# EAGLE design BR85_MKL_3309_21MTC_J0_004_01_06 (EAGLE 5.10)
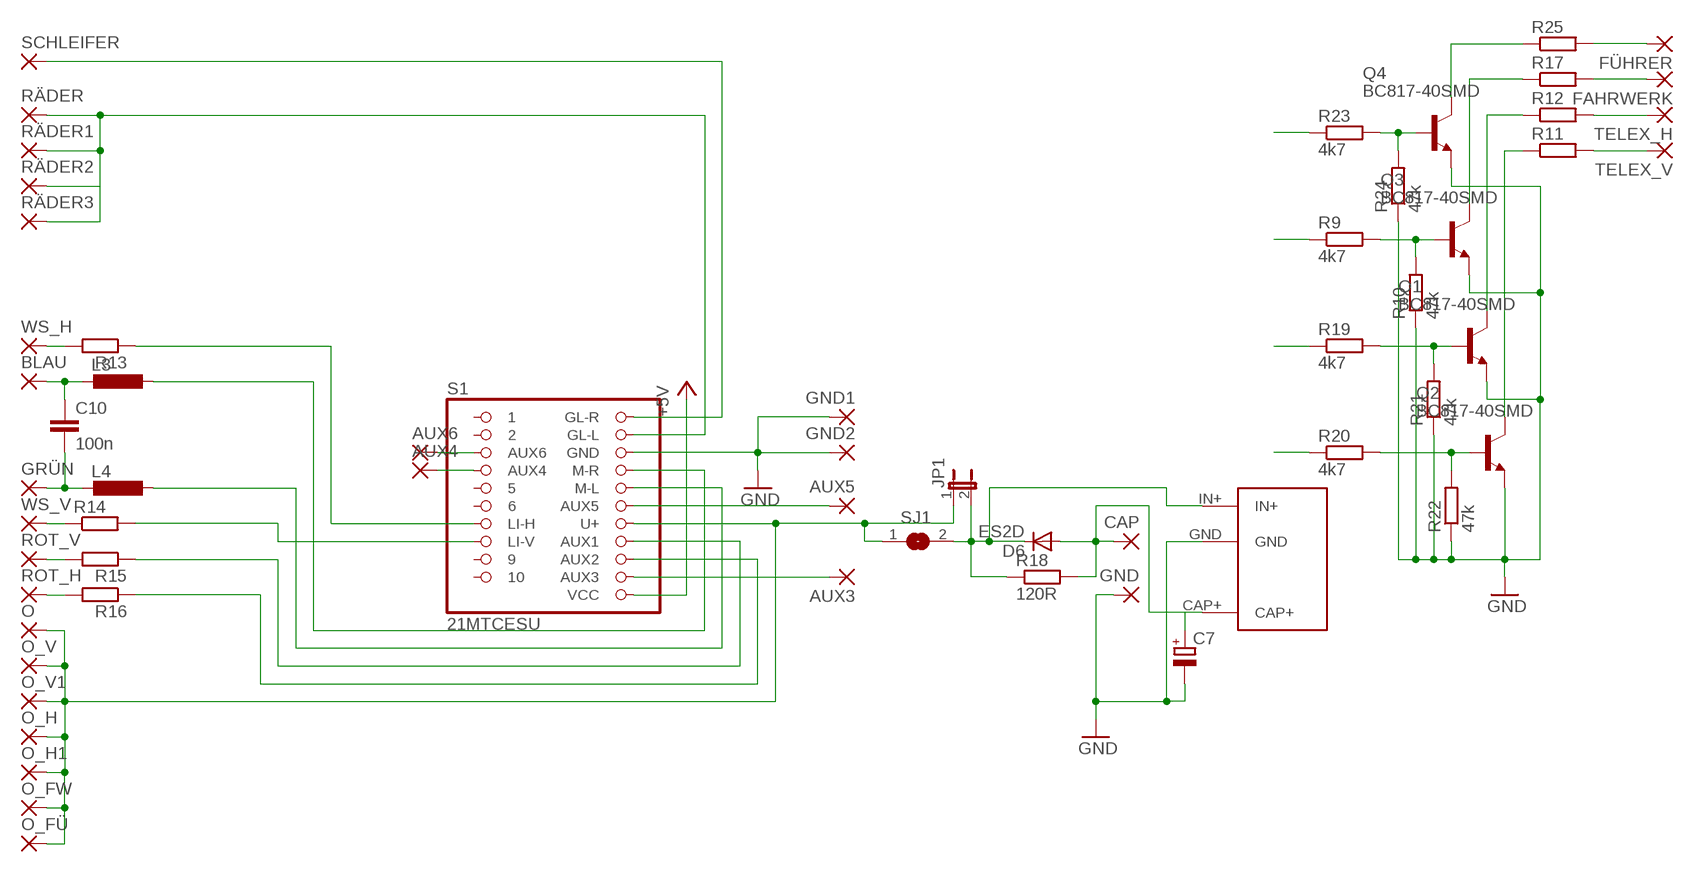
[diagram p0: schematic, sheet 1]

## Parts
AUX3  SMD2  [SMD1,27-2,54]
AUX4  SMD2  [SMD1,27-2,54]
AUX5  SMD2  [SMD1,27-2,54]
AUX6  SMD2  [SMD1,27-2,54]
BLAU  SMD2  [SMD1,27-2,54]
C7  CPOL-EURECT  [RECT-13X14-9]
C10  100n  C-EUC0603  [C0603]
CAP  SMD2  [SMD1,27-2,54]
D6  ES2D  [SMB]
FAHRWERK  SMD2  [SMD1,27-2,54]
FÜHRER  SMD2  [SMD1,27-2,54]
GND  SMD2  [SMD1,27-2,54]
GND1  SMD2  [SMD1,27-2,54]
GND2  SMD2  [SMD1,27-2,54]
GRÜN  SMD2  [SMD1,27-2,54]
JP1  JP1E2,00  [JP1_2]
L3  L-EUL1212  [L1212]
L4  L-EUL1212  [L1212]
O  SMD2  [SMD1,27-2,54]
O_FW  SMD2  [SMD1,27-2,54]
O_FÜ  SMD2  [SMD1,27-2,54]
O_H  SMD2  [SMD1,27-2,54]
O_H1  SMD2  [SMD1,27-2,54]
O_V  SMD2  [SMD1,27-2,54]
O_V1  SMD2  [SMD1,27-2,54]
Q1  BC817-40SMD  [SOT23-BEC]
Q2  BC817-40SMD  [SOT23-BEC]
Q3  BC817-40SMD  [SOT23-BEC]
Q4  BC817-40SMD  [SOT23-BEC]
R9  4k7  R-EU_R0603  [R0603]
R10  47k  R-EU_R0603  [R0603]
R11  R-EU_R0603S  [R0603S]
R12  R-EU_R0603S  [R0603S]
R13  R-EU_R0603S  [R0603S]
R14  R-EU_R0603S  [R0603S]
R15  R-EU_R0603S  [R0603S]
R16  R-EU_R0603S  [R0603S]
R17  R-EU_R0603S  [R0603S]
R18  120R  R-EU_R0603  [R0603]
R19  4k7  R-EU_R0603  [R0603]
R20  4k7  R-EU_R0603  [R0603]
R21  47k  R-EU_R0603  [R0603]
R22  47k  R-EU_R0603  [R0603]
R23  4k7  R-EU_R0603  [R0603]
R24  47k  R-EU_R0603  [R0603]
R25  R-EU_R0603S  [R0603S]
ROT_H  SMD2  [SMD1,27-2,54]
ROT_V  SMD2  [SMD1,27-2,54]
RÄDER  SMD2  [SMD1,27-2,54]
RÄDER1  SMD2  [SMD1,27-2,54]
RÄDER2  SMD2  [SMD1,27-2,54]
RÄDER3  SMD2  [SMD1,27-2,54]
S1  21MTCESU  [21MTC_SMD_ESU]
SCHLEIFER  SMD2  [SMD1,27-2,54]
SJ1  SJ"  [SJ]
TELEX_H  SMD2  [SMD1,27-2,54]
TELEX_V  SMD2  [SMD1,27-2,54]
U$1  PWR_CAPT  [POWER_CAP]
WS_H  SMD2  [SMD1,27-2,54]
WS_V  SMD2  [SMD1,27-2,54]

## Nets
+5V: S1.P12(VCC)
AUX1: R15.1 S1.P15(AUX1)
AUX2: R16.1 S1.P14(AUX2)
AUX3: AUX3.1(P) R9.1 S1.P13(AUX3)
AUX4: AUX4.1(P) R19.1 S1.P4(AUX4)
AUX5: AUX5.1(P) R23.1 S1.P17(AUX5)
AUX6: AUX6.1(P) R20.1 S1.P3(AUX6)
BLAU: L3.1 S1.P19(M-R)
CAP2: D6.C JP1.2 R18.1 SJ1.2 U$1.IN+
F3: R11.2 TELEX_V.1(P)
F4: R12.2 TELEX_H.1(P)
GND: C7.- GND1.1(P) GND2.1(P) GND.1(P) Q1.E Q2.E Q3.E Q4.E R10.1 R21.1 R22.1 R24.1 S1.P20(GND) U$1.GND
GRÜN: L4.1 S1.P18(M-L)
LI-H: R13.1 S1.P7(LI-H)
LI-V: R14.2 S1.P8(LI-V)
N$1: Q3.B R9.2 R10.2
N$2: Q4.B R23.2 R24.2
N$3: R15.2 ROT_V.1(P)
N$5: Q2.C R11.1
N$6: Q1.C R12.1
N$7: Q1.B R19.2 R21.2
N$8: Q2.B R20.2 R22.2
N$9: R13.2 WS_H.1(P)
N$10: R14.1 WS_V.1(P)
N$11: R16.2 ROT_H.1(P)
N$12: C7.+ CAP.1(P) D6.A R18.2 U$1.CAP+
N$14: C10.2 GRÜN.1(P) L4.2
N$15: BLAU.1(P) C10.1 L3.2
N$16: Q4.C R25.1
N$17: FAHRWERK.1(P) R17.2
N$18: Q3.C R17.1
N$20: FÜHRER.1(P) R25.2
ORANGE: JP1.1 O.1(P) O_FW.1(P) O_FÜ.1(P) O_H1.1(P) O_H.1(P) O_V1.1(P) O_V.1(P) S1.P16(U+) SJ1.1
RÄDER: RÄDER1.1(P) RÄDER2.1(P) RÄDER3.1(P) RÄDER.1(P) S1.P21(GL-L)
SCHLEIFER: S1.P22(GL-R) SCHLEIFER.1(P)
Unconnected: S1.P1 S1.P2 S1.P5 S1.P6 S1.P9 S1.P10

## Library data of the parts
AUX3-AUX6 BLAU CAP FAHRWERK FÜHRER GND GND1 GND2 GRÜN O O_FW O_FÜ O_H O_H1 O_V O_V1 ROT_H ROT_V RÄDER RÄDER1-RÄDER3 SCHLEIFER TELEX_H TELEX_V WS_H WS_V = wirepad:SMD2: SMD PAD
C7 = rcl:CPOL-EU: POLARIZED CAPACITOR, European symbol
C10 = rcl:C-EU: CAPACITOR, European symbol
D6 = diode:ES2D: DIODE super fast rectifier, 2 A
JP1 = jumper:JP1E: JUMPER
L3 L4 = rcl:L-EU: INDUCTOR, European symbol
Q1-Q4 = transistor-npn:BC817*: NPN Transistor
R9-R25 = rcl:R-EU_: RESISTOR, European symbol
S1 = pinhead:21MTC
SJ1 = jumper:SJ: SMD solder JUMPER
U$1 = pinhead:PWR_CAP

## Board
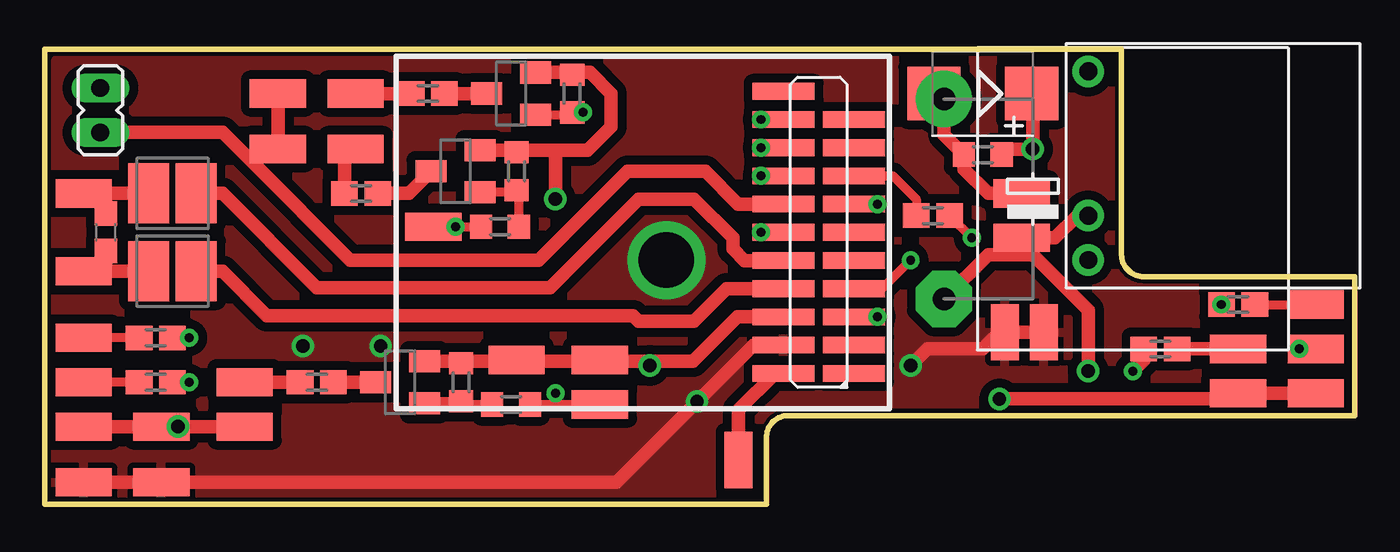
[diagram p1: board, top side]
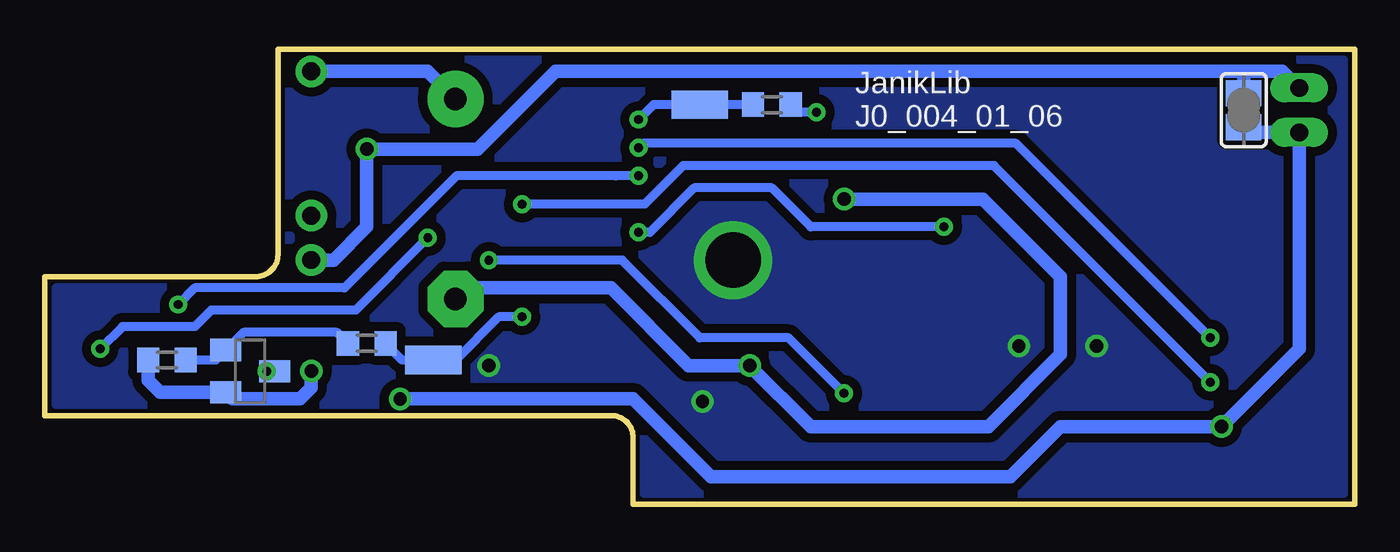
[diagram p2: board, bottom side, seen from below]

No outline drawn. Coordinates in mm, seen from the top.
Copper layers (1*16): Top 0.035mm / dielectric 1.5mm / Bottom 0.035mm
Design rules "default *": minimum track width 10mil, minimum drill 0.4mm, track to track 8mil, track to pad 8mil, pad to pad 8mil, via to via 8mil, smd to smd 8mil, copper to edge 40mil, drill to drill 8mil, minimum pad ring 10mil, minimum via ring 8mil, stop-mask expansion 4mil, vias tented up to drill 0mil, thermal gap 10mil
Milling: 10 lines

### Footprints (pad centres in the part's own frame; a part is rotated, then mirrored left to right if it is on the bottom)
SMD1,27-2,54 = smd 1.27 x 2.54: 1 0,0
RECT-13X14-9 = drill 1.016 pad 2.54 round: + -4.5,0 | drill 1.016 pad 2.54 octagon: - 4.5,0
C0603 = smd 1.1 x 1: 1 -0.85,0; 2 0.85,0
SMB = smd 2.4 x 2.4: A 2.2,0; C -2.2,0
JP1_2 = drill 0.8 long: 1 0,-1; 2 0,1
L1212 = smd 1.85 x 2.7: 1 -1.075,0; 2 1.075,0
SOT23-BEC = smd 1 x 1.4: B -0.95,-1.1; C 0,1.1; E 0.95,-1.1
R0603 = smd 1 x 1.1: 1 -0.85,0; 2 0.85,0
R0603S = smd 1.2 x 1.1: 1 -0.75,0; 2 0.75,0
21MTC_SMD_ESU = smd 0.75 x 2.8: P1 -6.35,-0.953; P2 -5.08,-0.953; P3 -3.81,-0.953; P4 -2.54,-0.953; P5 -1.27,-0.953; P6 0,-0.953; P7 1.27,-0.953; P8 2.54,-0.953; P9 3.81,-0.953; P10 5.08,-0.953; P12 6.35,2.223; P13 5.08,2.223; P14 3.81,2.223; P15 2.54,2.223; P16 1.27,2.223; P17 0,2.223; P18 -1.27,2.223; P19 -2.54,2.223; P20 -3.81,2.223; P21 -5.08,2.223; P22 -6.35,2.223
SJ = smd 1.168 x 1.6: 1 -0.762,0; 2 0.762,0
POWER_CAP = drill 0.8 pad 1.422 round: CAP+ 0,-6.5; GND 0,0; IN+ 0,2

### Placement (x,y rotation side)
AUX3  13.5,18 90 bottom
AUX4  9,4.5 90 top
AUX5  1.5,12.5 90 top
AUX6  25.5,6.5 90 bottom
BLAU  -14.25,10.5 270 top
C7  24.5,13.75 270 top
C10  -13.25,12.25 90 top
CAP  28,14 90 top
D6  26.25,18.5 180 top
FAHRWERK  -2,18.5 90 top
FÜHRER  -2,16 90 top
GND  28,12 90 top
GND1  5.25,6.5 270 top
GND2  9,6.5 90 top
GRÜN  -14.25,14 270 top
JP1  -13.5,17.75 0 top
L3  -10.25,10.5 180 top
L4  -10.25,14 180 top
O  -10.75,3.5 270 top
O_FW  -5.5,18.5 90 top
O_FÜ  -5.5,16 90 top
O_H  -7,3.5 90 top
O_H1  -14.25,3.5 270 top
O_V  37.75,5 90 top
O_V1  41.25,5 90 top
Q1  0,5.5 90 top
Q2  33.75,6 270 bottom
Q3  5,18.5 90 top
Q4  2.5,15 90 top
R9  10.25,18 0 bottom
R10  7.75,18.5 270 top
R11  34.25,7 0 top
R12  -3.75,5.5 180 top
R13  -11,5.5 180 top
R14  24,13 180 top
R15  37.75,9 0 top
R16  -11,7.5 180 top
R17  1.25,18.5 180 top
R18  26.25,15.75 180 top
R19  5,4.5 180 top
R20  28.5,7.25 180 bottom
R21  2.75,5.5 270 top
R22  37.5,6.5 0 bottom
R23  4.5,12.5 0 top
R24  5.25,15 270 top
R25  -1.75,14 180 top
ROT_H  -14.25,7.5 90 top
ROT_V  41.25,9 90 top
RÄDER  29,7.75 180 top
RÄDER1  27.25,7.75 180 top
RÄDER2  -14.25,1 90 top
RÄDER3  -10.75,1 90 top
S1  19.5,12.25 90 top
SCHLEIFER  15.25,2 180 top
SJ1  -11,17.75 90 bottom
TELEX_H  -7,5.5 90 top
TELEX_V  37.75,7 90 top
U$1  31,13 180 top
WS_H  -14.25,5.5 90 top
WS_V  41.25,7 90 top

### Tracks (layer width: path | path; a pad name or v marks a point on that pad's centre or on a via)
AUX1  (via drill 0.4)
  Top 0.406: S1.P15 v16.25,14.79
  Bottom 0.406: R15.1 36.25,9.75 29.5,9.75 24.46,14.79 S1.P15 v16.25,14.79
  other vias: 37,9
AUX2  (via drill 0.4)
  Top 0.406: v-9.5,7.5 R16.1 | v16.25,16.06 S1.P14
  Bottom 0.406: 16.19,16 v16.25,16.06 16.06,16.25 -0.75,16.25 v-9.5,7.5
AUX3  (via drill 0.4)
  Top 0.406: v16.25,17.33 S1.P13
  Bottom 0.406: R9.1 AUX3.1 15.58,18 v16.25,17.33
AUX4  (via drill 0.4)
  Top 0.406: v23,11 21.71,9.71 S1.P4 | R19.1 7,4.5 | 7,4.5 v7,5 | 7,4.5 AUX4.1
  Bottom 0.406: v23,11 17,11 13.5,7.5 9.5,7.5 v7,5
AUX5  (via drill 0.4)
  Top 0.406: v16.25,12.25 S1.P17 | AUX5.1 v2.5,12.5 R23.1
  Bottom 0.406: v16.25,12.25 15.75,12.25 13.75,14.25 10.25,14.25 8.5,12.5 v2.5,12.5
AUX6  (via drill 0.4)
  Top 0.406: S1.P3 v21.5,8.44
  Bottom 0.406: v21.5,8.44 22.56,8.44 24.5,6.5 AUX6.1 26.9,6.5 R20.1
BLAU
  Top 0.61: S1.P19 14.71,9.71 13.25,8.25 10.75,8.25 10.5,8.5 -6,8.5 -8,10.5 L3.1
CAP2  (via drill 0.6)
  Top 0.61: D6.C 28.5,18.45 v28.5,16 27.25,16 R18.1
  Bottom 0.61: JP1.2 -12.75,19.5 -11,19.5 | -11,19.5 SJ1.2 | -11,19.5 20,19.5 23.5,16 v28.5,16 28.5,12.5 30,11 U$1.IN+
F3
  Top 0.61: R11.2 TELEX_V.1
F4
  Top 0.61: TELEX_H.1 R12.2
GND  (via drill 0.6)
  Top 0.61: 2.75,6.45 Q1.E | S1.P20 15.19,8.44 13.2,6.45 11.25,6.45 | 7.75,19.45 8.55,19.45 9.5,18.5 9.5,17 8.45,15.95 7,15.95 | 5.25,15.95 Q4.E | 7.75,19.45 R10.1 | 7.75,19.45 Q3.E | v7,13.75 7,15.95 | 5.25,15.95 R24.1 | 7,15.95 5.25,15.95 | 9,6.45 GND2.1 | 11.25,6.45 9,6.45 | 5.25,6.45 GND1.1 | 9,6.45 5.25,6.45 | 2.75,6.45 R21.1 | 5.25,6.45 2.75,6.45 | v11.25,6.25 11.25,6.45 | GND.1 27.5,12 | U$1.GND 30.5,13 29.5,12 GND.1 | v31,6 31,8.75 28.5,11.25 28,11.25 | 28,11.25 26.5,11.25 C7.- | 28,11.25 GND.1
  Bottom 0.61: C7.- 24,9.75 17.5,9.75 14,6.25 v11.25,6.25 8.5,3.5 0.5,3.5 -2.75,6.75 -2.75,10.25 0.75,13.75 v7,13.75 | R22.1 38.35,5.6 37.8,5.05 Q2.E 34.55,4.75 31.5,4.75 31,5.25 v31,6
GRÜN
  Top 0.61: L4.1 -8,14 -3.75,9.75 6.75,9.75 10.75,13.75 13.25,13.75 15,12 15,11.5 15.52,10.98 S1.P18
LI-H  (via drill 0.4)
  Top 0.406: v-9.5,5.5 R13.1 | v21.5,13.52 S1.P7
  Bottom 0.406: v21.5,13.52 15.98,13.52 14.25,15.25 0.25,15.25 v-9.5,5.5
LI-V
  Top 0.406: S1.P8 22.21,14.79 23.25,13.75 R14.2
N$1  (via drill 0.4)
  Top 0.406: Q3.B 7.65,17.55 R10.2 v8.25,17.65
  Bottom 0.406: v8.25,17.65 9.05,17.65 R9.2
N$2
  Top 0.406: Q4.B 5.15,14.05 R24.2 5.35,14.05 R23.2
N$3
  Top 0.406: R15.2 ROT_V.1
N$5  (via drill 0.4)
  Top 0.61: v33,6 33.5,6.5 R11.1
  Bottom 0.61: Q2.C v33,6
N$6
  Top 0.61: R12.1 Q1.C
N$7
  Top 0.406: Q1.B 1.2,4.65 R21.2 2.9,4.5 R19.2
N$8
  Bottom 0.406: R20.2 29.85,7.75 34.05,7.75 Q2.B 35.3,6.5 R22.2
N$9
  Top 0.406: R13.2 WS_H.1
N$10  (via drill 0.4)
  Top 0.406: v40.5,7 WS_V.1 | R14.1 v25.75,12
  Bottom 0.406: v40.5,7 39.5,8 36.25,8 35.5,8.75 29,8.75 v25.75,12
N$11
  Top 0.406: R16.2 ROT_H.1
N$12
  Top 0.61: D6.A 24.3,18.25 C7.+ 24.5,16.65 R18.2 25.4,15.1 26.5,14 CAP.1
  Bottom 0.61: U$1.CAP+ 25.75,19.5 C7.+
N$14
  Top 0.61: -13.25,14 L4.2 | -13.25,14 GRÜN.1 | C10.2 -13.25,14
N$15
  Top 0.61: -13.25,10.5 BLAU.1 | -13.25,10.5 C10.1 | L3.2 -13.25,10.5
N$16
  Top 0.61: R25.1 0.4,14 Q4.C
N$17
  Top 0.61: FAHRWERK.1 R17.2
N$18
  Top 0.61: R17.1 Q3.C
N$20
  Top 0.61: R25.2 -2.5,15.5 FÜHRER.1
ORANGE  (via drill 0.6)
  Top 0.61: O_H1.1 O.1 v-10,3.5 O_H.1 | O_V1.1 O_V.1 37,5 36.75,4.75 v27,4.75 | S1.P16 15.23,13.52 13.75,15 10.25,15 6.25,11 -2.25,11 -6.62,15.38 | JP1.1 -8,16.75 -6.62,15.38 | -6.62,15.38 -6,16 O_FÜ.1 O_FW.1
  Bottom 0.61: v27,4.75 16.5,4.75 13,1.25 -0.5,1.25 -2.75,3.5 v-10,3.5 -13.5,7 JP1.1 -11.24,16.75 SJ1.1
RÄDER  (via drill 0.6, 2.5)
  Top 0.61: S1.P21 15.92,7.17 v13.38,4.62 9.75,1 RÄDER3.1 RÄDER2.1 | RÄDER.1 RÄDER1.1 27,7.75 26.25,7 23.75,7 v23,6.25
  other vias: 12,11 -0.88,7.12 -4.38,7.12
  pour Top (isolate 0.406, rank 2): -15.5,20 32,20 32,11.25 arc90 33.5,9.75 42.5,9.75 42.5,4.5 17.5,4.5 arc90 16,3 16,0.5 -15.5,0.5
  pour Bottom (isolate 0.406, rank 2): -15.5,20 32,20 32,11.25 arc90 33.5,9.75 42.5,9.75 42.5,4.5 17.5,4.5 arc90 16,3 16,0.5 -15.5,0.5
SCHLEIFER
  Top 0.61: SCHLEIFER.1 15.25,4.25 16.9,5.9 S1.P22

### Text on the board
bNames: JanikLib | J0_004_01_06
tStop: BR85 21MTC für Märklin 3309 | design by Janik Merz
bStop: design by Janik Merz